# Altium schematic sheet main.SchDoc
size A2
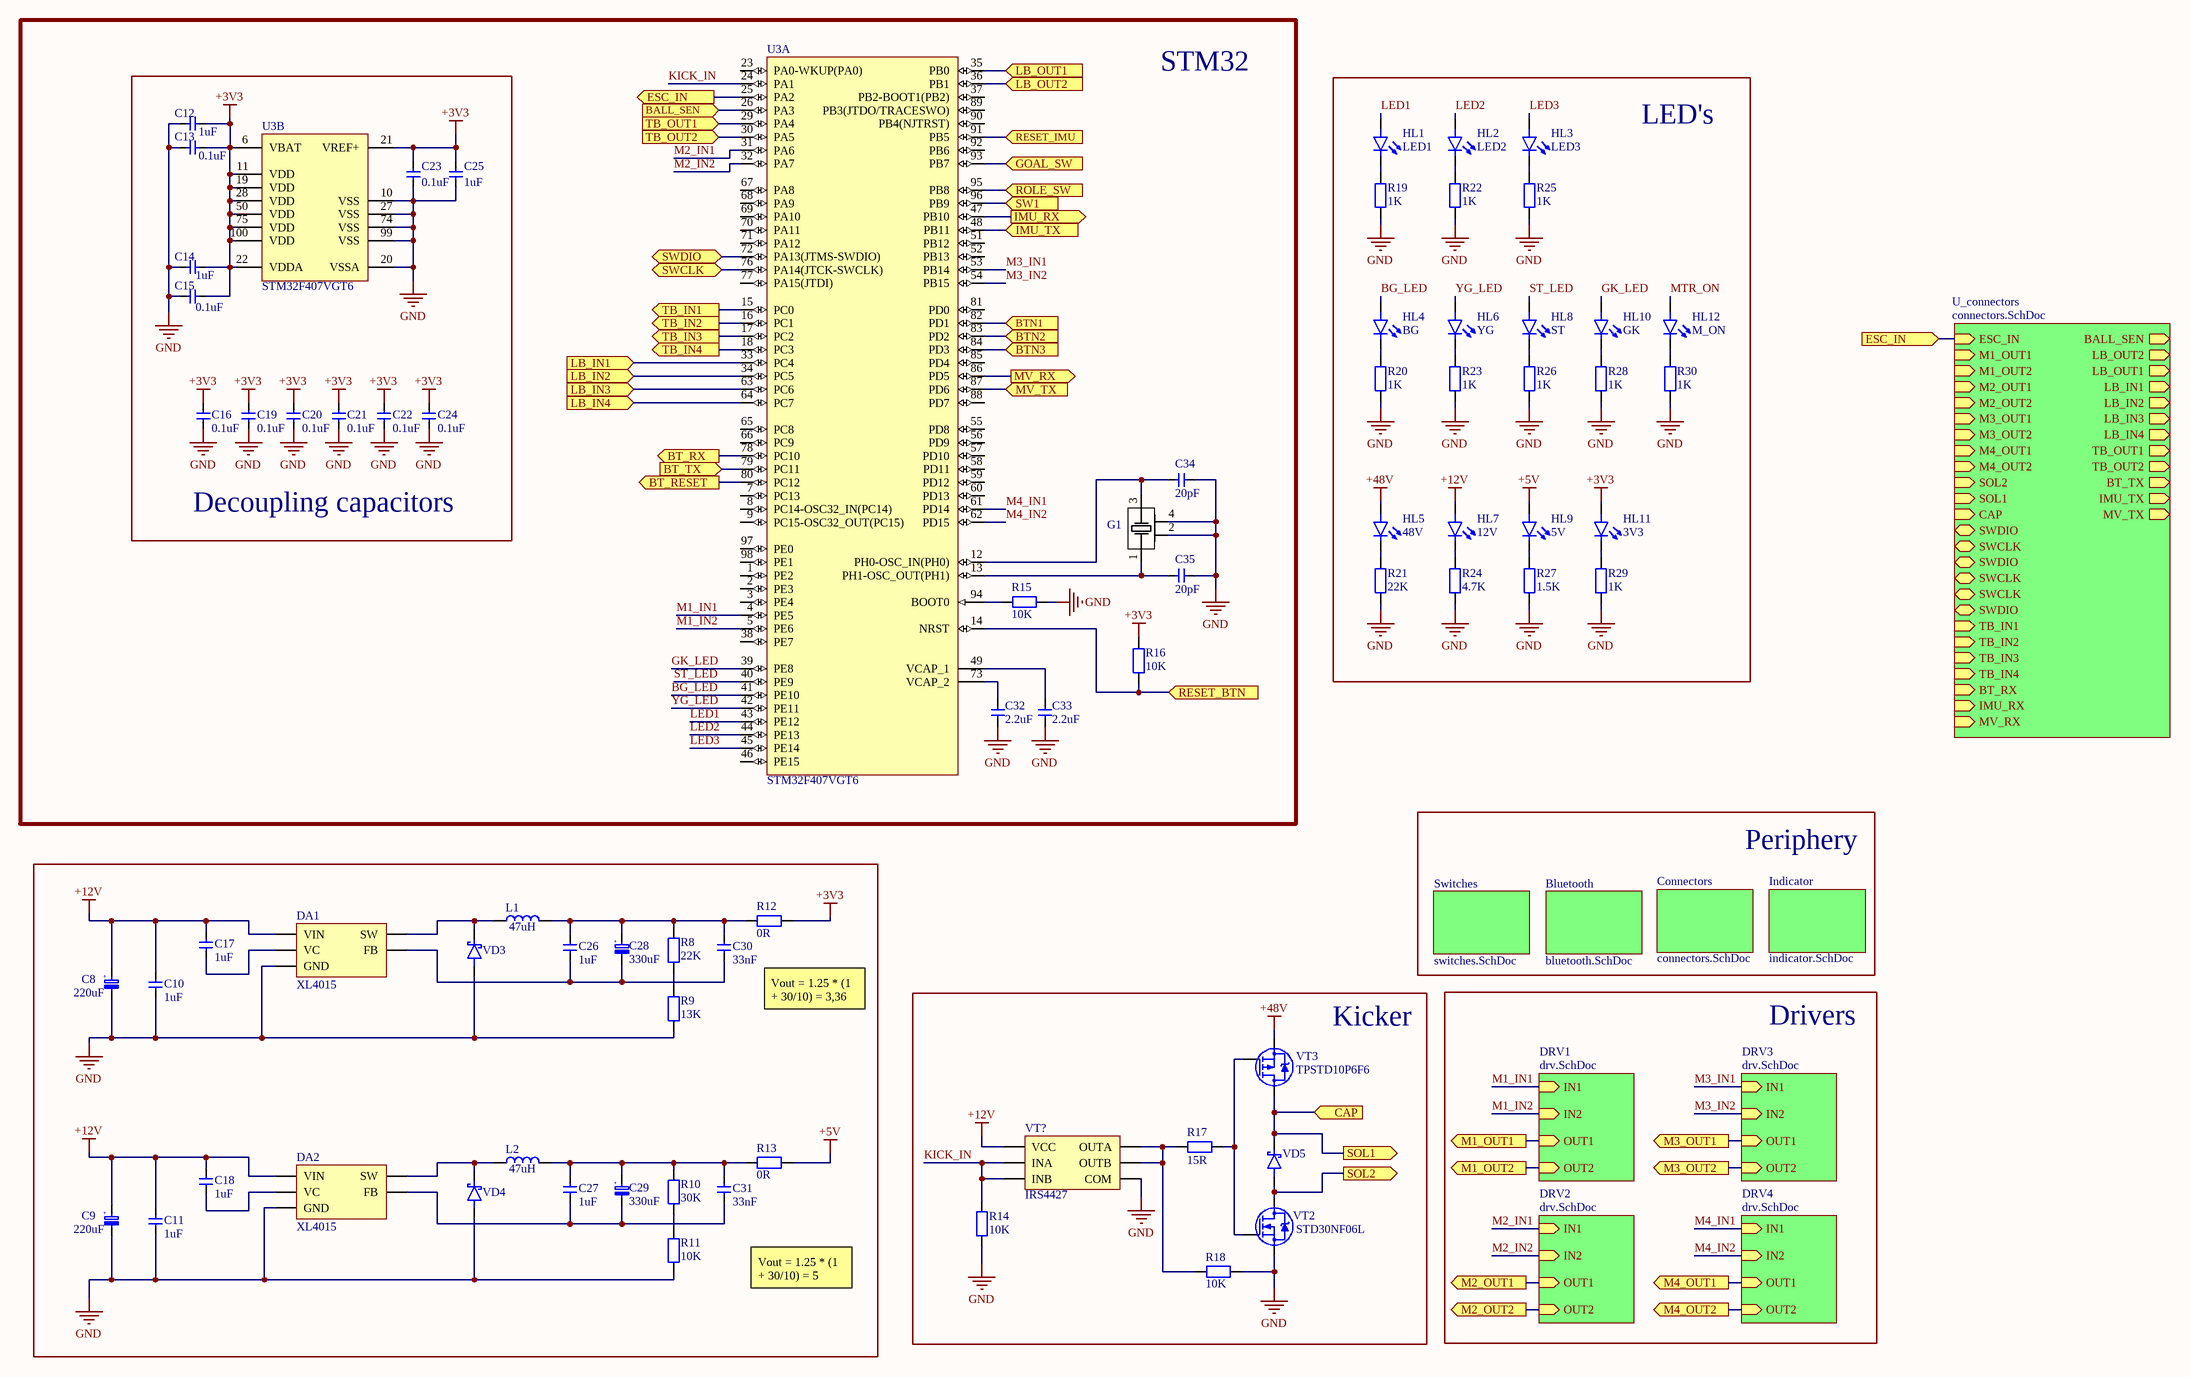
[diagram p0: main.SchDoc]

## Parts
C8  220uF  [D8C3.2H12]
C9  220uF  [D8C3.2H12]
C10  1uF  [CAP0805]
C11  1uF  [CAP0805]
C12  1uF  [CAP0805]
C13  0.1uF  [CAP0805]
C14  1uF  [CAP0805]
C15  0.1uF  [CAP0805]
C16  0.1uF  [CAP0805]
C17  1uF  [CAP0805]
C18  1uF  [CAP0805]
C19  0.1uF  [CAP0805]
C20  0.1uF  [CAP0805]
C21  0.1uF  [CAP0805]
C22  0.1uF  [CAP0805]
C23  0.1uF  [CAP0805]
C24  0.1uF  [CAP0805]
C25  1uF  [CAP0805]
C26  1uF  [CAP0805]
C27  1uF  [CAP0805]
C28  330uF  [D8C3.2H12]
C29  330uF  [D8C3.2H12]
C30  33nF  [CAP0805]
C31  33nF  [CAP0805]
C32  2.2uF  [CAP0805]
C33  2.2uF  [CAP0805]
C34  20pF  [CAP0805]
C35  20pF  [CAP0805]
DA1  XL4015  [TO263-5L]
DA2  XL4015  [TO263-5L]
G1  8 MHz  [TSX-3225]  (value not drawn)
HL1  LED1  [LED0603_WHITE]
HL2  LED2  [LED0603_WHITE]
HL3  LED3  [LED0603_WHITE]
HL4  BG  [LED0603_WHITE]
HL5  48V  [LED0603_GREEN]
HL6  YG  [LED0603_WHITE]
HL7  12V  [LED0603_GREEN]
HL8  ST  [LED0603_WHITE]
HL9  5V  [LED0603_GREEN]
HL10  GK  [LED0603_WHITE]
HL11  3V3  [LED0603_GREEN]
HL12  M_ON  [LED0603_RED]
L1  47uH  [VLS3012HBX]
L2  47uH  [VLS3012HBX]
R8  22K  [RES0805]
R9  13K  [RES0805]
R10  30K  [RES0805]
R11  10K  [RES0805]
R12  0R  [RES1206]
R13  0R  [RES1206]
R14  10K  [RES0805]
R15  10K  [RES0805]
R16  10K  [RES0805]
R17  15R  [RES1206]
R18  10K  [RES0805]
R19  1K  [RES0805]
R20  1K  [RES0805]
R21  22K  [RES0805]
R22  1K  [RES0805]
R23  1K  [RES0805]
R24  4.7K  [RES0805]
R25  1K  [RES0805]
R26  1K  [RES0805]
R27  1.5K  [RES0805]
R28  1K  [RES0805]
R29  1K  [RES0805]
R30  1K  [RES0805]
U3  STM32F407VGT6  [LQFP100]  (parts A,B of 2)
VD3  Diode Schottky  [DO-214AC (SMA)]  (value not drawn)
VD4  Diode Schottky  [DO-214AC (SMA)]  (value not drawn)
VD5  Diode Schottky  [DO-214AC (SMA)]  (value not drawn)
VT2  STD30NF06L  [DPAK]
VT3  TPSTD10P6F6  [DPAK]
VT?  IRS4427  [SOIC-8]

## Blocks framed on the sheet
STM32: C32-C35 G1 R15 R16 U3
Decoupling capacitors: C12-C16 C19-C25 U3
LED's: HL1-HL12 R19-R30
Kicker: R14 R17 R18 VD5 VT2 VT3 VT?

## Sub-sheets
Bluetooth = bluetooth.SchDoc: no entries
Connectors = connectors.SchDoc: no entries
DRV1 = drv.SchDoc: IN1 (in), OUT2 (in), IN2 (in), OUT1 (in)
DRV2 = drv.SchDoc: IN1 (in), OUT2 (in), IN2 (in), OUT1 (in)
DRV3 = drv.SchDoc: IN1 (in), OUT2 (in), IN2 (in), OUT1 (in)
DRV4 = drv.SchDoc: IN1 (in), OUT2 (in), IN2 (in), OUT1 (in)
Indicator = indicator.SchDoc: no entries
Switches = switches.SchDoc: no entries
U_connectors = connectors.SchDoc: ESC_IN (in), M1_OUT1 (in), M1_OUT2 (in), M2_OUT1 (in), M2_OUT2 (in), M3_OUT1 (in), M3_OUT2 (in), M4_OUT1 (in), M4_OUT2 (in), SOL2 (in), SOL1 (in), CAP (in), BALL_SEN (out), SWDIO (bidir), SWCLK (bidir), SWDIO (bidir), SWCLK (bidir), SWCLK (bidir), SWDIO (bidir), LB_OUT2 (out), LB_OUT1 (out), LB_IN1 (out), LB_IN2 (out), LB_IN3 (out), LB_IN4 (out), TB_IN1 (in), TB_IN2 (in), TB_IN3 (in), TB_IN4 (in), TB_OUT1 (out), TB_OUT2 (out), BT_TX (out), BT_RX (in), IMU_RX (in), IMU_TX (out), MV_RX (in), MV_TX (out)

## Ports
BALL_SEN (in), BT_RESET (out), BT_RX (out), BT_TX (in), BTN1 (in), BTN2 (in), BTN3 (in), CAP (in), ESC_IN (in), ESC_IN (out), GOAL_SW (in), IMU_RX (out), IMU_TX (in), LB_IN1 (in), LB_IN2 (in), LB_IN3 (in), LB_IN4 (in), LB_OUT1 (in), LB_OUT2 (in), M1_OUT1 (out), M1_OUT2 (out), M2_OUT1 (out), M2_OUT2 (out), M3_OUT1 (out), M3_OUT2 (out), M4_OUT1 (out), M4_OUT2 (out), MV_RX (out), MV_TX (in), RESET_BTN (in), RESET_IMU (in), ROLE_SW (in), SOL1 (out), SOL2 (out), SW1 (in), SWCLK (bidir), SWDIO (bidir), TB_IN1 (out), TB_IN2 (out), TB_IN3 (out), TB_IN4 (out), TB_OUT1 (in), TB_OUT2 (in)

## Nets
+3V3: C12.1 C13.1 C14.1 C15.1 C16.1 C19.1 C20.1 C21.1 C22.1 C23.2 C24.1 C25.2 HL11.2(A) R12.2 R16.1 U3.6(VBAT) U3.11(VDD) U3.19(VDD) U3.21(VREF+) U3.22(VDDA) U3.28(VDD) U3.50(VDD) U3.75(VDD) U3.100(VDD)
+5V: HL9.2(A) R13.2
+12V: C8.1(PLUS) C9.1(PLUS) C10.2 C11.2 C17.2 C18.2 DA1.5(VIN) DA2.5(VIN) HL7.2(A) VT?.6(VCC)
+48V: HL5.2(A) VT3.S
GND: C8.2(MINUS) C9.2(MINUS) C10.1 C11.1 C12.2 C13.2 C14.2 C15.2 C16.2 C19.2 C20.2 C21.2 C22.2 C23.1 C24.2 C25.1 C32.1 C33.1 C34.2 C35.2 DA1.1(GND) DA2.1(GND) G1.2 G1.4 R9.1 R11.1 R14.1 R15.1 R18.2 R19.1 R20.1 R21.1 R22.1 R23.1 R24.1 R25.1 R26.1 R27.1 R28.1 R29.1 R30.1 U3.10(VSS) U3.20(VSSA) U3.27(VSS) U3.74(VSS) U3.99(VSS) VD3.A VD4.A VT2.S VT?.3(COM)
BALL_SEN: U3.26(PA3) ; port BALL_SEN
BG_LED: HL4.2(A) U3.41(PE10)
BT_RESET: U3.80(PC12) ; port BT_RESET
BT_RX: U3.78(PC10) ; port BT_RX
BT_TX: U3.79(PC11) ; port BT_TX
BTN1: U3.82(PD1) ; port BTN1
BTN2: U3.83(PD2) ; port BTN2
BTN3: U3.84(PD3) ; port BTN3
CAP: VD5.K VT3.D ; port SOL1, port CAP
ESC_IN: U3.25(PA2) ; port ESC_IN, sheet U_connectors/ESC_IN
GK_LED: HL10.2(A) U3.39(PE8)
GOAL_SW: U3.93(PB7) ; port GOAL_SW
IMU_RX: U3.47(PB10) ; port IMU_RX
IMU_TX: U3.48(PB11) ; port IMU_TX
KICK_IN: R14.2 U3.24(PA1) VT?.2(INA) VT?.4(INB)
LB_IN1: U3.33(PC4) ; port LB_IN1
LB_IN2: U3.34(PC5) ; port LB_IN2
LB_IN3: U3.63(PC6) ; port LB_IN3
LB_IN4: U3.64(PC7) ; port LB_IN4
LB_OUT1: U3.35(PB0) ; port LB_OUT1
LB_OUT2: U3.36(PB1) ; port LB_OUT2
LED1: HL1.2(A) U3.43(PE12)
LED2: HL2.2(A) U3.44(PE13)
LED3: HL3.2(A) U3.45(PE14)
M1_IN1: U3.4(PE5) ; sheet DRV1/IN1
M1_IN2: U3.5(PE6) ; sheet DRV1/IN2
M1_OUT1: port M1_OUT1, sheet DRV1/OUT1
M1_OUT2: port M1_OUT2, sheet DRV1/OUT2
M2_IN1: U3.31(PA6) ; sheet DRV2/IN1
M2_IN2: U3.32(PA7) ; sheet DRV2/IN2
M2_OUT1: port M2_OUT1, sheet DRV2/OUT1
M2_OUT2: port M2_OUT2, sheet DRV2/OUT2
M3_IN1: U3.53(PB14) ; sheet DRV3/IN1
M3_IN2: U3.54(PB15) ; sheet DRV3/IN2
M3_OUT1: port M3_OUT1, sheet DRV3/OUT1
M3_OUT2: port M3_OUT2, sheet DRV3/OUT2
M4_IN1: U3.61(PD14) ; sheet DRV4/IN1
M4_IN2: U3.62(PD15) ; sheet DRV4/IN2
M4_OUT1: port M4_OUT1, sheet DRV4/OUT1
M4_OUT2: port M4_OUT2, sheet DRV4/OUT2
MTR_ON: HL12.2(A)
MV_RX: U3.86(PD5) ; port MV_RX
MV_TX: U3.87(PD6) ; port MV_TX
RESET_BTN: R16.2 U3.14(NRST) ; port RESET_BTN
RESET_IMU: U3.91(PB5) ; port RESET_IMU
ROLE_SW: U3.95(PB8) ; port ROLE_SW
SOL2: VD5.A VT2.D ; port SOL2
ST_LED: HL8.2(A) U3.40(PE9)
SW1: U3.96(PB9) ; port SW1
SWCLK: U3.76(PA14(JTCK-SWCLK)) ; port SWCLK
SWDIO: U3.72(PA13(JTMS-SWDIO)) ; port SWDIO
TB_IN1: U3.15(PC0) ; port TB_IN1
TB_IN2: U3.16(PC1) ; port TB_IN2
TB_IN3: U3.17(PC2) ; port TB_IN3
TB_IN4: U3.18(PC3) ; port TB_IN4
TB_OUT1: U3.29(PA4) ; port TB_OUT1
TB_OUT2: U3.30(PA5) ; port TB_OUT2
YG_LED: HL6.2(A) U3.42(PE11)
NetC17_1: C17.1 DA1.4(VC)
NetC18_1: C18.1 DA2.4(VC)
NetC26_1: C26.1 C28.2(MINUS) C30.1 DA1.2(FB)
NetC26_2: C26.2 C28.1(PLUS) C30.2 L1.2 R8.2 R12.1
NetC27_1: C27.1 C29.2(MINUS) C31.1 DA2.2(FB)
NetC27_2: C27.2 C29.1(PLUS) C31.2 L2.2 R10.2 R13.1
NetC32_2: C32.2 U3.73(VCAP_2)
NetC33_2: C33.2 U3.49(VCAP_1)
NetC34_1: C34.1 G1.3 U3.12(PH0-OSC_IN(PH0))
NetC35_1: C35.1 G1.1 U3.13(PH1-OSC_OUT(PH1))
NetDA1_3: DA1.3(SW) L1.1 VD3.K
NetDA2_3: DA2.3(SW) L2.1 VD4.K
NetHL1_1: HL1.1(K) R19.2
NetHL2_1: HL2.1(K) R22.2
NetHL3_1: HL3.1(K) R25.2
NetHL4_1: HL4.1(K) R20.2
NetHL5_1: HL5.1(K) R21.2
NetHL6_1: HL6.1(K) R23.2
NetHL7_1: HL7.1(K) R24.2
NetHL8_1: HL8.1(K) R26.2
NetHL9_1: HL9.1(K) R27.2
NetHL10_1: HL10.1(K) R28.2
NetHL11_1: HL11.1(K) R29.2
NetHL12_1: HL12.1(K) R30.2
NetR8_1: R8.1 R9.2
NetR10_1: R10.1 R11.2
NetR15_2: R15.2 U3.94(BOOT0)
NetR17_1: R17.1 R18.1 VT?.5(OUTB) VT?.7(OUTA)
NetR17_2: R17.2 VT2.G VT3.G

Not connected (* = marked no-connect by the designer): U3 1(PE2) 2(PE3) 3(PE4) 7(PC13) 8(PC14-OSC32_IN(PC14)) 9(PC15-OSC32_OUT(PC15)) 23(PA0-WKUP(PA0)) 37(PB2-BOOT1(PB2)) 38(PE7) 46(PE15) 51(PB12) 52(PB13) 55(PD8) 56(PD9) 57(PD10) 58(PD11) 59(PD12) 60(PD13) 65(PC8) 66(PC9) 67(PA8) 68(PA9) 69(PA10) 70(PA11) 71(PA12) 77(PA15(JTDI)) 81(PD0) 85(PD4) 88(PD7) 89(PB3(JTDO/TRACESWO)) 90(PB4(NJTRST)) 92(PB6) 97(PE0) 98(PE1)

## Notes on the sheet
- Periphery
- Vout = 1.25 * (1 + 30/10) = 3,36
- Drivers
- Vout = 1.25 * (1 + 30/10) = 5
- (in symbol Cap Aluminum) +

## Library data of the parts
C8 C9 = Cap Aluminum: 50V
C10-C27 C30-C35 = CAP Ceramic: Ceramic SMD Cap
C28 C29 = Cap Aluminum: 25V
DA1 DA2 = XL4015: Buck converter
G1 = TSX-3225 24.0000MF15X-AC6: 24MHz ±10ppm Crystal 9pF 40 Ohms 4-SMD, No Lead; Part Number: TSX-3225 24.0000MF15X-AC6; HelpURL: https://www.digikey.com/en/products/detail/epson/TSX-3225-24-0000MF15X-AC6/5261221; Price$: 0.33; Digi-Key Part Number: SER4180CT-ND; Manufacturer Part Number: TSX-3225 24.0000MF15X-AC6
HL1-HL12 = LED: LED smd
L1 L2 = Inductor: 5A
R8-R30 = RES: RES smd
U3 = STM32F407VGT6: ARM Cortex-M4 32-bit MCU+FPU, 210 DMIPS, 1024 kB Flash, 192 kB Internal RAM, 82 I/Os, 100-pin LQFP, -40 to 85 degC, Tray; Manufacturer: STMicroelectronics; D/A Converter: 2x12-bit; FLASH Size (Prog) (kB): 1024; I/Os (High Current): 82; Internal RAM Size (kB): 192; Operating Frequency(F) (Processor speed) (MHz): 168; Supply Voltage(Vcc) max (V): 3.6; Supply Voltage(Vcc) min (V): 1.8; DatasheetVersion: Rev. 4; PackageVersion: Rev. 1, 06/2013; PackageReference: LQFP100; PackageDescription: 100-Pin Low Profile Quad Flat Package, 14 x 14 mm Body, 0.5 mm Pitch; Supplier 1: Digi-Key; Supplier Part Number 1: 497-11605-ND; Supplier 2: Farnell; Supplier Part Number 2: 2064368; Supplier 3: Newark; Supplier Part Number 3: 73T2333; Supplier 4: Mouser; Supplier Part Number 4: 511-STM32F407VGT6; Core: ARM Cortex-M4; Packing: Tray; Mounting Technology: Surface Mount; PartNumber: STM32F407VGT6; ComponentLink1Description: Manufacturer URL; ComponentLink1URL: http://www.st.com/web/en/home.html; ComponentLink2Description: Datasheet; ComponentLink2URL: http://www.st.com/st-web-ui/static/active/en/resource/technical/document/datasheet/DM00037051.pdf; ComponentLink3Description: Package Specification; ComponentLink3URL: http://www.st.com/st-web-ui/static/active/en/resource/technical/document/data_brief/DM00071938.pdf
VT2 = STD30NF06L: N-MOSFET / Uds = 60 V / Ids = 30 A / Rds = 0.023 Ohm / P = 55 W; ComponentLink1Description: Chipdip; ComponentLink1URL: https://www.chipdip.ru/product/std30nf06l-umw
VT3 = TPSTD10P6F6: P-MOSFET / Uds = 60 V / Ids = 13 A / Rds = 0.100 Ohm / P = 60 W; ComponentLink1Description: Chipdip; ComponentLink1URL: https://www.chipdip.ru/product/tpstd10p6f6
VT? = IRS4427: Mosfet driver